# EAGLE schematic attiny_pwm (EAGLE 7.5.0)
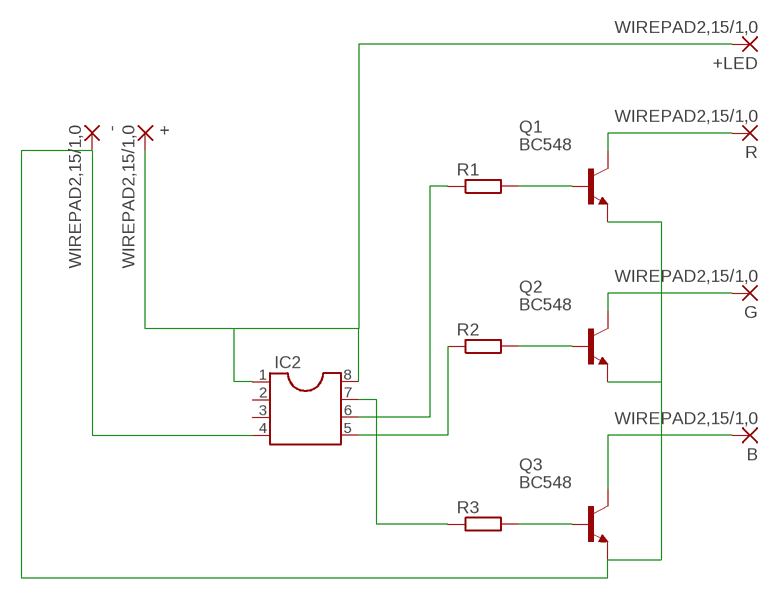
[diagram p0: schematic, sheet 1]

## Parts
+  WIREPAD2,15/1,0  [2,15/1,0]
+LED  WIREPAD2,15/1,0  [2,15/1,0]
-  WIREPAD2,15/1,0  [2,15/1,0]
B  WIREPAD2,15/1,0  [2,15/1,0]
G  WIREPAD2,15/1,0  [2,15/1,0]
IC2  DIL8  [DIL08]
Q1  BC548  [TO92-EBC]
Q2  BC548  [TO92-EBC]
Q3  BC548  [TO92-EBC]
R  WIREPAD2,15/1,0  [2,15/1,0]
R1  R-EU_0207/10  [0207/10]
R2  R-EU_0207/10  [0207/10]
R3  R-EU_0207/10  [0207/10]

## Nets
N$1: -.1(P) IC2.4 Q1.E Q2.E Q3.E
N$2: Q1.B R1.2
N$3: Q2.B R2.2
N$4: Q3.B R3.2
N$5: Q1.C R.1(P)
N$6: G.1(P) Q2.C
N$7: B.1(P) Q3.C
N$9: IC2.5 R2.1
N$10: IC2.6 R1.1
N$11: IC2.7 R3.1
N$12: +.1(P) +LED.1(P) IC2.1 IC2.8
Unconnected: IC2.2 IC2.3

## Library data of the parts
+ +LED - B G R = wirepad:WIREPAD: Wire PAD connect wire on PCB
IC2 = ic-package:DIL8: Dual In Line / Socket
Q1-Q3 = transistor-npn:BC548*: NPN Transistor
R1-R3 = resistor:R-EU_: RESISTOR, European symbol